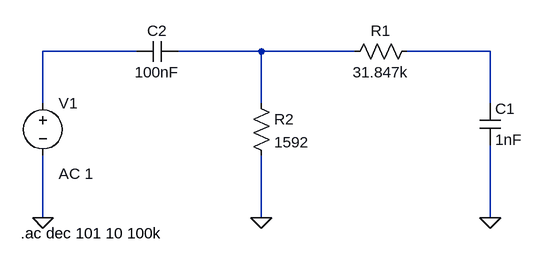
[diagram p0: schematic Band Pass Filter.asc]
Band Pass Filter.asc, the LTspice schematic file:
Version 4
SHEET 1 880 680
WIRE -256 16 -400 16
WIRE -64 16 -192 16
WIRE 80 16 -64 16
WIRE 288 16 160 16
WIRE -400 96 -400 16
WIRE -64 96 -64 16
WIRE 288 96 288 16
WIRE -400 272 -400 176
WIRE -64 272 -64 176
WIRE 288 272 288 160
FLAG -400 272 0
FLAG 288 272 0
FLAG -64 272 0
SYMBOL voltage -400 80 R0
WINDOW 123 24 124 Left 2
WINDOW 39 0 0 Left 0
SYMATTR InstName V1
SYMATTR Value ""
SYMATTR Value2 AC 1
SYMBOL res 176 0 R90
WINDOW 0 0 56 VBottom 2
WINDOW 3 32 56 VTop 2
SYMATTR InstName R1
SYMATTR Value 31.847k
SYMBOL cap 272 96 R0
SYMATTR InstName C1
SYMATTR Value 1nF
SYMBOL cap -192 0 R90
WINDOW 0 0 32 VBottom 2
WINDOW 3 32 32 VTop 2
SYMATTR InstName C2
SYMATTR Value 100nF
SYMBOL res -80 80 R0
SYMATTR InstName R2
SYMATTR Value 1592
TEXT -434 296 Left 2 !.ac dec 101 10 100k

The netlist it stands for:
* Band Pass Filter.asc
V1 N001 0 AC 1
R1 N003 N002 31.847k
C1 N003 0 1nF
C2 N002 N001 100nF
R2 N002 0 1592
.ac dec 101 10 100k
.backanno
.end